# Altium schematic sheet Sheet1.SchDoc
size A; CompanyName: Simplexity Product Development; Organization: Simplexity Product Development
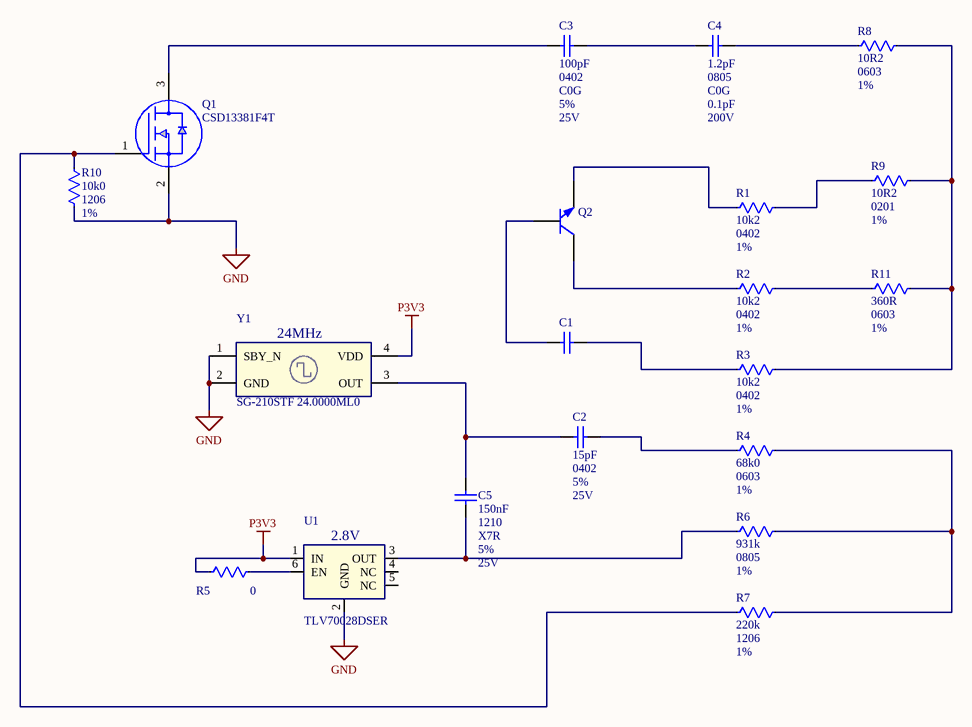
[diagram p0: Sheet1.SchDoc]

## Parts
C1  100pF  [CAPC_0201(0603)_P33_N]  (value not drawn)
C2  Package_Case: 0402  Tolerance: 5%  Voltage_Rating: 25V  [CAPC_0402(1005)_P55_N]  (hidden comment: 15pF)
C3  100pF  Package_Case: 0402  Dielectric: C0G  Tolerance: 5%  Voltage_Rating: 25V  [CAPC_0402(1005)_P55_N]
C4  1.2pF  Package_Case: 0805  Dielectric: C0G  Tolerance: 0.1pF  Voltage_Rating: 200V  [CAPC_0805(2012)_P95_N]
C5  150nF  Package_Case: 1210  Dielectric: X7R  Tolerance: 5%  Voltage_Rating: 25V  [CAPC_1210(3225)_P9_N]
Q1  CSD13381F4T  [MOSFET3_TI_CSD13381F4T]
Q2  MMBT3904-7-F  [SOT-23]  (value not drawn)
R1  10k2  Package_Case: 0402  Tolerance: 1%  [RESC_0402(1005)_P4_N]
R2  10k2  Package_Case: 0402  Tolerance: 1%  [RESC_0402(1005)_P4_N]
R3  10k2  Package_Case: 0402  Tolerance: 1%  [RESC_0402(1005)_P4_N]
R4  68k0  Package_Case: 0603  Tolerance: 1%  [RESC_0603(1608)_P55_N]
R5  0  [RESC_0603(1608)_P55_N]
R6  931k  Package_Case: 0805  Tolerance: 1%  [RESC_0805(2012)_P6_N]
R7  220k  Package_Case: 1206  Tolerance: 1%  [RESC_1206(3216)_P6_N]
R8  10R2  Package_Case: 0603  Tolerance: 1%  [RESC_0603(1608)_P55_N]
R9  10R2  Package_Case: 0201  Tolerance: 1%  [RESC_0201(0603)_P28_N]
R10  10k0  Package_Case: 1206  Tolerance: 1%  [RESC_1206(3216)_P6_N]
R11  360R  Package_Case: 0603  Tolerance: 1%  [RESC_0603(1608)_P55_N]
U1  TLV70028DSER  [TI DSE S-PWSON-N6]
Y1  SG-210STF 24.0000ML0  [Epson SG-210STF]

## Nets
GND: Q1.2(S) R10.2 U1.2(GND) Y1.1(SBY_N) Y1.2(GND)
P3V3: R5.2 U1.1(IN) Y1.4(VDD)
NetC1_1: C1.1 Q2.2(B)
NetC1_2: C1.2 R3.2
NetC2_1: C2.1 C5.2 Y1.3(OUT)
NetC2_2: C2.2 R4.2
NetC3_1: C3.1 Q1.3(D)
NetC3_2: C3.2 C4.1
NetC4_2: C4.2 R8.2
NetC5_1: C5.1 R6.2 U1.3(OUT)
NetQ1_1: Q1.1(G) R7.2 R10.1
NetQ2_1: Q2.1(E) R1.2
NetQ2_3: Q2.3(C) R2.2
NetR1_1: R1.1 R9.2
NetR2_1: R2.1 R11.2
NetR3_1: R3.1 R8.1 R9.1 R11.1
NetR4_1: R4.1 R6.1 R7.1
NetR5_1: R5.1 U1.6(EN)

Not connected (* = marked no-connect by the designer): U1 4(NC) 5(NC)

## Notes on the sheet
- PCAName:
- Size:
- Date:
- A
- Number:
- Sheet
- Rev:
- of
- Author:
- File:
- (in symbol 30010) 24MHz
- (in symbol 30016) 2.8V

## Library data of the parts
C1 = 30030: Part_Type: Capacitor; Mfr Part Number: C0201C101J3GACTU; Manufacturer: KEMET; Mfr Part Description: CAP CER 100pF ±5% 25V NPO 0201 (0603 Metric); ID: 30030; Sub_Type: Ceramic; Dielectric: NPO; Tolerance: ±5%; Voltage_Rating: 25V; Updated By: KristinPollock; Value: 100pF; Supplier: Digi-Key; Supplier Part Number: 399-8925-1-ND; Package_Case: 0201 (0603 Metric); RoHS: Yes; Temperature Range: -55C to +125C; Created By: KristinPollock; Created_Date: 2018/04/12 11:43:49; Checked By: KristinPollock; Checked_Date: 2018/04/12 14:14:25; Updated_Date: 2018/04/12 15:12:48; LifeCycle: New; ComponentLink1Description: Datasheet; ComponentLink1URL: https://search.kemet.com/component-edge/download/datasheet/C0201C101J3GACTU.pdf; ComponentLink2Description: Supplier Part Details; ComponentLink2URL: https://www.digikey.com/product-detail/en/kemet/C0201C101J3GACTU/399-8925-1-ND/3522442
C2 = 0402J150AX3: Cap, Cer, 15pF, 5%, 25V, 0402, C0G; Part_Type: Capacitor; Mfr Part Number: 04023A150JAT; Manufacturer: AVX; Alt_Part Number: C0402C150J3GACTU; Alt_Mfr: Kemet; Sub_Type: Ceramic; ValueSort: 15; ID: 0402J150AX3; Value: 15pF; RoHS: Yes; Temperature Range: -55C to +125C; Dielectric: C0G; Created By: DJH Script; Created_Date: 2018-10-18 19:17:33; Checked By: DJH Script; Checked_Date: 2018-10-18 19:17:33; LifeCycle: New
C3 = 0402J101AX3: Cap, Cer, 100pF, 5%, 25V, 0402, C0G; Part_Type: Capacitor; Mfr Part Number: 04023A101JAT; Manufacturer: AVX; Alt_Mfr: Kemet; Alt_Part Number: C0402C101J3GACTU; Sub_Type: Ceramic; ValueSort: 100; ID: 0402J101AX3; Value: 100pF; RoHS: Yes; Temperature Range: -55C to +125C; Created By: DJH Script; Created_Date: 2018-10-18 19:17:33; Checked By: DJH Script; Checked_Date: 2018-10-18 19:17:33; LifeCycle: New
C4 = 0805B129AX2: Cap, Cer, 1.2pF, 0.1pF, 200V, 0805, C0G; Part_Type: Capacitor; Mfr Part Number: 08052A1R2BAT; Manufacturer: AVX; Alt_Mfr: Kemet; Alt_Part Number: C0805C129B2GACTU; Sub_Type: Ceramic; ValueSort: 1.2; ID: 0805B129AX2; Value: 1.2pF; RoHS: Yes; Temperature Range: -55C to +125C; Created By: DJH Script; Created_Date: 2018-10-18 19:17:43; Checked By: DJH Script; Checked_Date: 2018-10-18 19:17:43; LifeCycle: New
C5 = 1210J154CX3: Cap, Cer, 150nF, 5%, 25V, 1210, X7R; Part_Type: Capacitor; Mfr Part Number: 12103C154JAT; Manufacturer: AVX; Alt_Part Number: C1210C154J3RACTU; Alt_Mfr: Kemet; Sub_Type: Ceramic; ValueSort: 150000; ID: 1210J154CX3; Value: 150nF; RoHS: Yes; Temperature Range: -55C to +125C; Created By: DJH Script; Created_Date: 2018-10-18 19:17:52; Checked By: DJH Script; Checked_Date: 2018-10-18 19:17:52; LifeCycle: New
Q1 = 30004: MOSFET N-CH 12V 2.1A 3PICOSTAR; Part_Type: Discrete; Manufacturer: Texas Instruments; MFG: TI; ID: 30004; Current_Rating: 2.1A (Ta); Updated By: Kristin Pollock; MPN: CSD13381F4T; Created by: Kristin Pollock; Created date: 2017-07-20; Checked by: Kristin Pollock; Checked date: 2017-09-28; Supplier 1: Digi-Key; Supplier Part Number 1: 296-37779-1-ND; Value: CSD13381F4T; Sub_Type: FET N-CH; Mfr Part Number: CSD13381F4T; Mfr Part Description: MOSFET N-CH 12V 2.1A 3PICOSTAR; Supplier: Digi-Key; Supplier Part Number: 296-37779-1-ND; Package_Case: 3-XFDFN; RoHS: Yes; Temperature Range: -55C to +150C (TJ); Voltage_Rating: 12V; Created_Date: 2018/03/05 11:40:06; Checked_Date: 2018/03/05 11:42:27; Updated_Date: 2018/03/05 11:53:56; LifeCycle: New; ComponentLink1Description: Datasheet; ComponentLink1URL: http://www.ti.com/lit/ds/symlink/csd13381f4.pdf; ComponentLink2Description: Supplier Part Details; ComponentLink2URL: https://www.digikey.com/product-detail/en/CSD13381F4T/296-37779-1-ND
Q2 = 30027: NPN General Purpose Amplifier; Part_Type: Discrete; Manufacturer: Diodes Incorporated; Mfr Part Description: TRANS NPN 40V 0.2A SMD SOT23-3; MFG: Diodes Inc; MTG: SMT; SPN: MMBT3904-FDICT-ND; SPR: Digikey; ID: 30027; Sub_Type: BJT NPN; Voltage_Rating: 40V; Current_Rating: 200mA; Updated By: DaveHough; MPN: MMBT3904-7-F; Value: MMBT3904-7-F; Mfr Part Number: MMBT3904-7-F; Supplier: Digi-Key; Supplier Part Number: MMBT3904-FDICT-ND; Package_Case: TO-236-3, SC-59, SOT-23-3; RoHS: Yes; Temperature Range: -55C to +150C (TJ); Created By: DaveHough; Created_Date: 2018/04/10 10:51:11; Checked By: DaveHough; Checked_Date: 2018/04/19 15:36:23; Updated_Date: 2018/04/19 15:36:29; LifeCycle: New; ComponentLink1Description: Datasheet; ComponentLink1URL: https://media.digikey.com/pdf/Data%20Sheets/Diodes%20PDFs/MMBT3904.pdf; ComponentLink2Description: Supplier Part Details; ComponentLink2URL: https://www.digikey.com/products/en?keywords=MMBT3904-FDICT-ND
R1-R3 = 0402E1022XBX: Res 0402 1% 10k2 1/16W; Part_Type: chipResistor; Mfr Part Number: ERJ2RKF1022X; Manufacturer: Panasonic; Alt_Part Number: RC0402FR-0710K2L; Alt_Mfr: Yageo; Alt_Part Number2: CRCW040210K2FKED; Alt_Mfr2: Vishay Dale; Voltage_Rating: 50V; ValueSort: 10200; ID: 0402E1022XBX; Value: 10k2; RoHS: Yes; Temperature Range: -55C to +125C; Power_Rating: 1/16W; Created By: DJH Script; Created_Date: 2018-10-18 18:51:45; Checked By: DJH Script; Checked_Date: 2018-10-18 18:51:45; LifeCycle: New
R4 = 0603E6802XCX: Res 0603 1% 68k0 1/10W; Part_Type: chipResistor; Mfr Part Number: ERJ3EKF6802V; Manufacturer: Panasonic; Alt_Part Number: RC0603FR-0768KL; Alt_Mfr: Yageo; Alt_Part Number2: CRCW060368K0FKEA; Alt_Mfr2: Vishay Dale; Voltage_Rating: 75V; ValueSort: 68000; ID: 0603E6802XCX; Value: 68k0; RoHS: Yes; Temperature Range: -55C to +125C; Power_Rating: 1/10W; Created By: DJH Script; Created_Date: 2018-10-18 18:51:45; Checked By: DJH Script; Checked_Date: 2018-10-18 18:51:45; LifeCycle: New
R5 = 30019: Part_Type: Resistor; Mfr Part Number: RC0603JR-070RL; Manufacturer: Yageo; Mfr Part Description: RES 0 Ohm Jumper 1/10W 0603 (1608 Metric); ID: 30019; Tolerance: Jumper; Power_Rating: 0.1W, 1/10W; Updated By: KristinPollock; Value: 0; Supplier: Digi-Key; Supplier Part Number: 311-0.0GRCT-ND; Package_Case: 0603 (1608 Metric); RoHS: Yes; Temperature Range: -55C to +155C; Created By: Kristin Pollock; Created_Date: 2018/03/08 06:30:19; Checked By: Kristin Pollock; Checked_Date: 2018/03/08 06:36:08; Updated_Date: 2018/04/12 16:03:06; LifeCycle: New; ComponentLink1Description: Datasheet; ComponentLink1URL: http://www.yageo.com/documents/recent/PYu-RC_Group_51_RoHS_L_8.pdf; ComponentLink2Description: Supplier Part Details; ComponentLink2URL: https://www.digikey.com/products/en?x=0&y=0&lang=en&site=us&keywords=311-0.0GRCT-ND
R6 = 0805E9313XDX: Res 0805 1% 931k 1/8W; Part_Type: chipResistor; Mfr Part Number: ERJ6ENF9313V; Manufacturer: Panasonic; Alt_Part Number: RC0805FR-07931KL; Alt_Mfr: Yageo; Alt_Part Number2: CRCW0805931KFKEA; Alt_Mfr2: Vishay Dale; Voltage_Rating: 100V; ValueSort: 931000; ID: 0805E9313XDX; Value: 931k; RoHS: Yes; Temperature Range: -55C to +125C; Power_Rating: 1/8W; Created By: DJH Script; Created_Date: 2018-10-18 18:51:45; Checked By: DJH Script; Checked_Date: 2018-10-18 18:51:45; LifeCycle: New
R7 = 1206E2203XEX: Res 1206 1% 220k 1/4W; Part_Type: chipResistor; Mfr Part Number: ERJ8ENF2203V; Manufacturer: Panasonic; Alt_Part Number: RC1206FR-07220KL; Alt_Mfr: Yageo; Alt_Part Number2: CRCW1206220KFKEA; Alt_Mfr2: Vishay Dale; Voltage_Rating: 200V; ValueSort: 220000; Value: 220k; ID: 1206E2203XEX; RoHS: Yes; Temperature Range: -55C to +125C; Power_Rating: 1/4W; Created By: DJH Script; Created_Date: 2018-10-18 18:51:45; Checked By: DJH Script; Checked_Date: 2018-10-18 18:51:45; LifeCycle: New
R8 = 0603E1029XCX: Res 0603 1% 10R2 1/10W; Part_Type: chipResistor; Mfr Part Number: ERJ3EKF10R2V; Manufacturer: Panasonic; Alt_Part Number: RC0603FR-0710R2L; Alt_Mfr: Yageo; Alt_Part Number2: CRCW060310R2FKEA; Alt_Mfr2: Vishay Dale; Voltage_Rating: 75V; ValueSort: 10.2; ID: 0603E1029XCX; Value: 10R2; RoHS: Yes; Temperature Range: -55C to +125C; Power_Rating: 1/10W; Created By: DJH Script; Created_Date: 2018-10-18 18:51:45; Checked By: DJH Script; Checked_Date: 2018-10-18 18:51:45; LifeCycle: New
R9 = 0201E1029XAX: Res 0201 1% 10R2 1/20W; Part_Type: chipResistor; Mfr Part Number: ERJ1GNF10R2C; Manufacturer: Panasonic; Alt_Part Number: RC0201FR-0710R2L; Alt_Mfr: Yageo; Alt_Part Number2: CRCW020110R2FKED; Alt_Mfr2: Vishay Dale; Voltage_Rating: 25V; ValueSort: 10.2; ID: 0201E1029XAX; Value: 10R2; RoHS: Yes; Temperature Range: -55C to +125C; Power_Rating: 1/20W; Created By: DJH Script; Created_Date: 2018-10-18 18:51:45; Checked By: DJH Script; Checked_Date: 2018-10-18 18:51:45; LifeCycle: New
R10 = 1206E1002XEX: Res 1206 1% 10k0 1/4W; Part_Type: chipResistor; Mfr Part Number: ERJ8ENF1002V; Manufacturer: Panasonic; Alt_Part Number: RC1206FR-0710KL; Alt_Mfr: Yageo; Alt_Part Number2: CRCW120610K0FKEA; Alt_Mfr2: Vishay Dale; Voltage_Rating: 200V; ValueSort: 10000; Value: 10k0; ID: 1206E1002XEX; RoHS: Yes; Temperature Range: -55C to +125C; Power_Rating: 1/4W; Created By: DJH Script; Created_Date: 2018-10-18 18:51:45; Checked By: DJH Script; Checked_Date: 2018-10-18 18:51:45; LifeCycle: New
R11 = 0603E3600XCX: Res 0603 1% 360R 1/10W; Part_Type: chipResistor; Mfr Part Number: ERJ3EKF3600V; Manufacturer: Panasonic; Alt_Part Number: RC0603FR-07360RL; Alt_Mfr: Yageo; Alt_Part Number2: CRCW0603360RFKEA; Alt_Mfr2: Vishay Dale; Voltage_Rating: 75V; ValueSort: 360; ID: 0603E3600XCX; Value: 360R; RoHS: Yes; Temperature Range: -55C to +125C; Power_Rating: 1/10W; Created By: DJH Script; Created_Date: 2018-10-18 18:51:45; Checked By: DJH Script; Checked_Date: 2018-10-18 18:51:45; LifeCycle: New
U1 = 30016: IC REG LDO 2.8V 0.2A 6WSON; Manufacturer: Texas Instruments; Mfr Part Description: IC REG LINEAR 2.8V 200MA 6WSON; MFG: TI; ID: 30016; Sub_Type: REG LINEAR; Updated By: Kristin Pollock; MPN: TLV70028DSER; Created by: Kristin Pollock; Created date: 2017-08-30; Checked by: Kristin Pollock; Checked date: 2017-09-26; Supplier 1: Digi-Key; Supplier Part Number 1: 296-25291-1-ND; Value: TLV70028DSER; Part_Type: IC; Mfr Part Number: TLV70028DSER; Supplier: Digi-Key; Supplier Part Number: 296-25291-1-ND; Package_Case: 6-WFDFN; RoHS: Yes; Temperature Range: -40C to +125C; Created_Date: 2018/03/05 11:40:06; Checked_Date: 2018/03/05 11:52:06; Updated_Date: 2018/03/05 11:52:54; LifeCycle: New; ComponentLink1Description: Datasheet; ComponentLink1URL: http://www.ti.com/lit/ds/slvsa00e/slvsa00e.pdf; ComponentLink2Description: Supplier Part Details; ComponentLink2URL: https://www.digikey.com/product-detail/en/TLV70028DSER/296-25291-1-ND
Y1 = 30010: OSC XO 24.000MHZ CMOS SMD; Manufacturer: EPSON; MFG: Abracon; ID: 30010; Voltage_Rating: 1.6 V ~ 3.6 V; Current_Rating: 2.2mA; Updated By: Kristin Pollock; MPN: SG-210STF 24.0000ML0; Created by: Kristin Pollock; Created date: 2017-08-13; Checked by: Kristin Pollock; Checked date: 2017-09-26; Supplier 1: Digi-Key; Supplier Part Number 1: SER4078CT-ND; Value: SG-210STF 24.0000ML0; Part_Type: OSC; Mfr Part Number: SG-210STF 24.0000ML0; Mfr Part Description: OSC XO 24.000MHZ CMOS SMD; Supplier: Digi-Key; Supplier Part Number: SER4078CT-ND; Package_Case: 4-SMD, No Lead; RoHS: Yes; Temperature Range: -40C to +85C; Created_Date: 2018/03/05 11:40:06; Checked_Date: 2018/03/05 11:44:37; Updated_Date: 2018/03/05 11:53:19; LifeCycle: New; ComponentLink1Description: Datasheet; ComponentLink1URL: https://support.epson.biz/td/api/doc_check.php?dl=brief_SG-210STF_en.pdf; ComponentLink2Description: Supplier Part Details; ComponentLink2URL: https://www.digikey.com/product-detail/en/SG-210STF%2024.0000ML0/SER4078CT-ND